# Altium schematic sheet Power Stage.SchDoc: Power Unit Stage
size A3; Date: 28.08.2010; ApprovedBy: V.Gyurov; CheckedBy: V.Gyurov; Author: V.Gyurov; CompanyName: V.Gyurov; DrawnBy: V.Gyurov; Engineer: V.Gyurov; DocumentNumber: 2; Revision: 00; SheetNumber: 2; SheetTotal: 7; VersionControl_RevNumber: V1.00 R.00; CurrentDate: 28.08.2010; DocumentName: Power Unit Stage; ModifiedDate: 28.08.2010
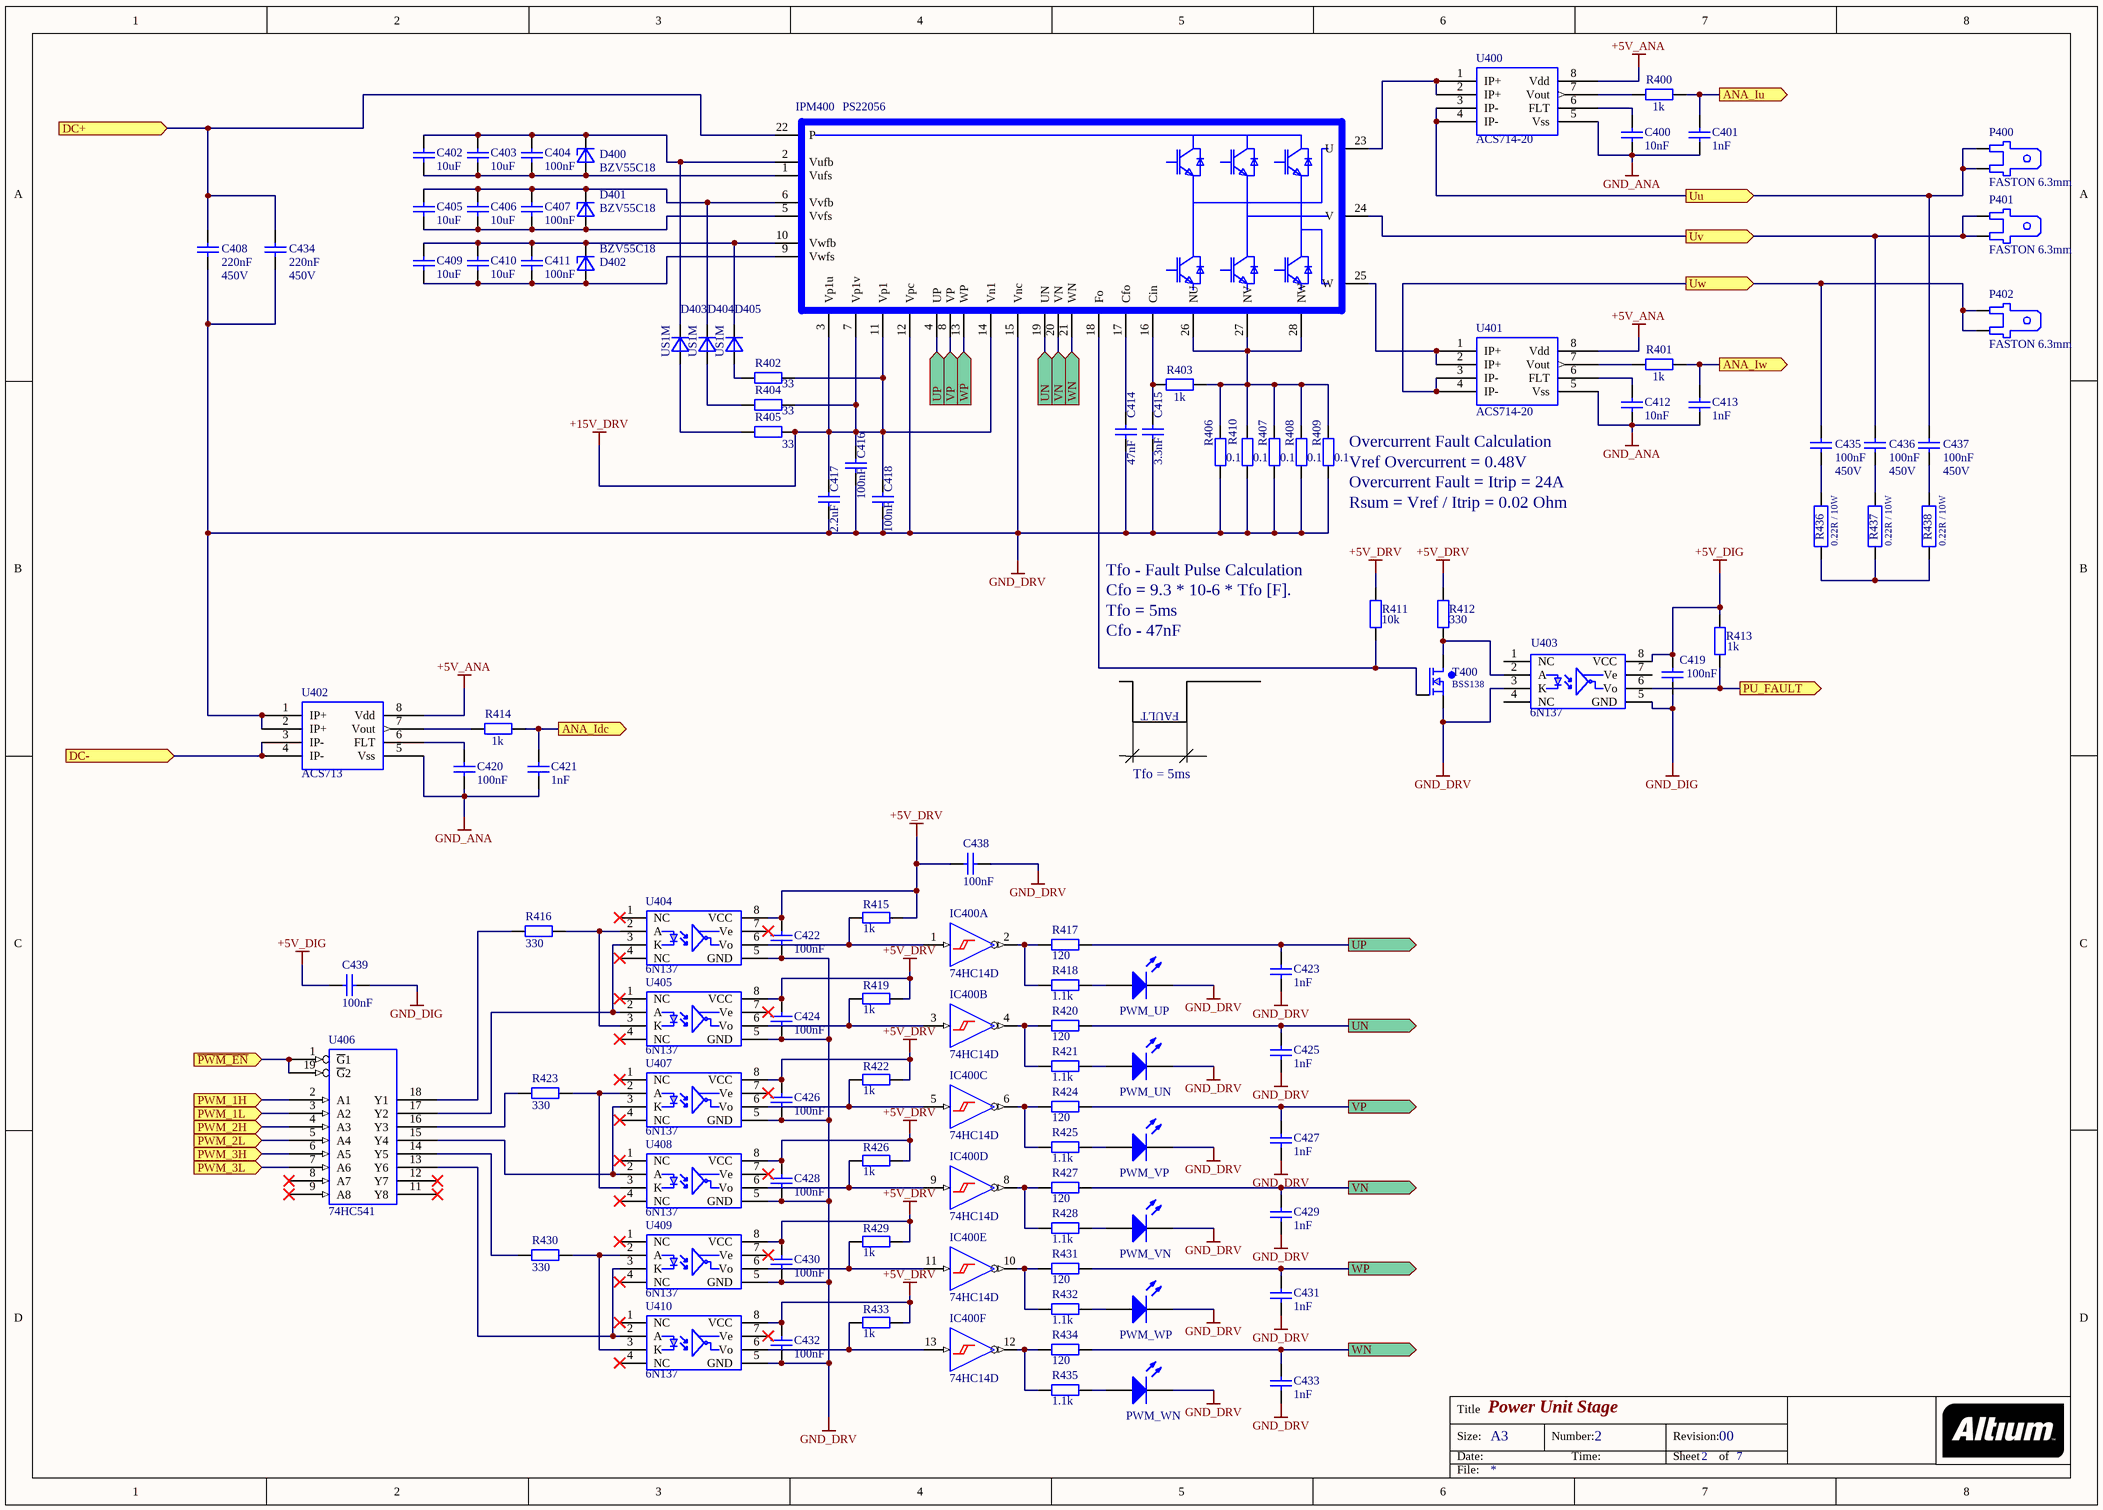
[diagram p0: Power Stage.SchDoc]

## Parts
C400  value 10nF  [1206_REFLOW]  (hidden comment: Cap 1206)
C401  value 1nF  [1206_REFLOW]  (hidden comment: Cap 1206)
C402  value 10uF  [1206_REFLOW]  (hidden comment: Cap 1206)
C403  value 10uF  [1206_REFLOW]  (hidden comment: Cap 1206)
C404  value 100nF  [1206_REFLOW]  (hidden comment: Cap 1206)
C405  value 10uF  [1206_REFLOW]  (hidden comment: Cap 1206)
C406  value 10uF  [1206_REFLOW]  (hidden comment: Cap 1206)
C407  value 100nF  [1206_REFLOW]  (hidden comment: Cap 1206)
C408  value 220nF  Voltage: 450V  [CAP26X19P22_5H]  (hidden comment: Cap)
C409  value 10uF  [1206_REFLOW]  (hidden comment: Cap 1206)
C410  value 10uF  [1206_REFLOW]  (hidden comment: Cap 1206)
C411  value 100nF  [1206_REFLOW]  (hidden comment: Cap 1206)
C412  value 10nF  [1206_REFLOW]  (hidden comment: Cap 1206)
C413  value 1nF  [1206_REFLOW]  (hidden comment: Cap 1206)
C414  value 47nF  [1206_REFLOW]  (hidden comment: Cap 1206)
C415  value 3.3nF  [1206_REFLOW]  (hidden comment: Cap 1206)
C416  value 100nF  [1206_REFLOW]  (hidden comment: Cap 1206)
C417  value 2.2uF  [1206_REFLOW]  (hidden comment: Cap 1206)
C418  value 100nF  [1206_REFLOW]  (hidden comment: Cap 1206)
C419  value 100nF  [1206_REFLOW]  (hidden comment: Cap 1206)
C420  value 100nF  [1206_REFLOW]  (hidden comment: Cap 1206)
C421  value 1nF  [1206_REFLOW]  (hidden comment: Cap 1206)
C422  value 100nF  [1206_REFLOW]  (hidden comment: Cap 1206)
C423  value 1nF  [1206_REFLOW]  (hidden comment: Cap 1206)
C424  value 100nF  [1206_REFLOW]  (hidden comment: Cap 1206)
C425  value 1nF  [1206_REFLOW]  (hidden comment: Cap 1206)
C426  value 100nF  [1206_REFLOW]  (hidden comment: Cap 1206)
C427  value 1nF  [1206_REFLOW]  (hidden comment: Cap 1206)
C428  value 100nF  [1206_REFLOW]  (hidden comment: Cap 1206)
C429  value 1nF  [1206_REFLOW]  (hidden comment: Cap 1206)
C430  value 100nF  [1206_REFLOW]  (hidden comment: Cap 1206)
C431  value 1nF  [1206_REFLOW]  (hidden comment: Cap 1206)
C432  value 100nF  [1206_REFLOW]  (hidden comment: Cap 1206)
C433  value 1nF  [1206_REFLOW]  (hidden comment: Cap 1206)
C434  value 220nF  Voltage: 450V  [CAP26X19P22_5H]  (hidden comment: Cap)
C435  value 100nF  Voltage: 450V  [CAP26X19P22_5H]  (hidden comment: Cap)
C436  value 100nF  Voltage: 450V  [CAP26X19P22_5H]  (hidden comment: Cap)
C437  value 100nF  Voltage: 450V  [CAP26X19P22_5H]  (hidden comment: Cap)
C438  value 100nF  [1206_REFLOW]  (hidden comment: Cap 1206)
C439  value 100nF  [1206_REFLOW]  (hidden comment: Cap 1206)
D400  value BZV55C18  [D_MINIMELF_BZV55C5V1(Primary)]  (hidden comment: BZV55CXXX)
D401  value BZV55C18  [D_MINIMELF_BZV55C5V1(Primary)]  (hidden comment: BZV55CXXX)
D402  value BZV55C18  [D_MINIMELF_BZV55C5V1(Primary)]  (hidden comment: BZV55CXXX)
D403  US1M  [DO-214_S1A(Primary)]
D404  value US1M  [DO-214_S1A(Primary)]  (hidden comment: S1A)
D405  value US1M  [DO-214_S1A(Primary)]  (hidden comment: S1A)
IC400  value 74HC14D  [SO14_HIS]  (hidden comment: SN74HC14D)  (parts A,B,C,D,E,F of 6)
IPM400  value PS22056  [PS22054]  (hidden comment: Component_1)
P400  FASTON 6.3MM  [FASTON 6.3mm]
P401  FASTON 6.3MM  [FASTON 6.3mm]
P402  FASTON 6.3MM  [FASTON 6.3mm]
PWM_UN  LED  [LED_1206]  (value not drawn)
PWM_UP  LED  [LED_1206]  (value not drawn)
PWM_VN  LED  [LED_1206]  (value not drawn)
PWM_VP  LED  [LED_1206]  (value not drawn)
PWM_WN  LED  [LED_1206]  (value not drawn)
PWM_WP  LED  [LED_1206]  (value not drawn)
R400  value 1k  [1206_REFLOW]  (hidden comment: RES)
R401  value 1k  [1206_REFLOW]  (hidden comment: RES)
R402  value 33  [1206_REFLOW]  (hidden comment: RES)
R403  value 1k  [1206_REFLOW]  (hidden comment: RES)
R404  value 33  [1206_REFLOW]  (hidden comment: RES)
R405  value 33  [1206_REFLOW]  (hidden comment: RES)
R406  value 0.1  [1206_REFLOW]  (hidden comment: RES)
R407  value 0.1  [1206_REFLOW]  (hidden comment: RES)
R408  value 0.1  [1206_REFLOW]  (hidden comment: RES)
R409  value 0.1  [1206_REFLOW]  (hidden comment: RES)
R410  value 0.1  [1206_REFLOW]  (hidden comment: RES)
R411  value 10k  [1206_REFLOW]  (hidden comment: RES)
R412  value 330  [1206_REFLOW]  (hidden comment: RES)
R413  value 1k  [1206_REFLOW]  (hidden comment: RES)
R414  value 1k  [1206_REFLOW]  (hidden comment: RES)
R415  value 1k  [1206_REFLOW]  (hidden comment: RES)
R416  value 330  [1206_REFLOW]  (hidden comment: RES)
R417  value 120  [1206_REFLOW]  (hidden comment: RES)
R418  value 1.1k  [1206_REFLOW]  (hidden comment: RES)
R419  value 1k  [1206_REFLOW]  (hidden comment: RES)
R420  value 120  [1206_REFLOW]  (hidden comment: RES)
R421  value 1.1k  [1206_REFLOW]  (hidden comment: RES)
R422  value 1k  [1206_REFLOW]  (hidden comment: RES)
R423  value 330  [1206_REFLOW]  (hidden comment: RES)
R424  value 120  [1206_REFLOW]  (hidden comment: RES)
R425  value 1.1k  [1206_REFLOW]  (hidden comment: RES)
R426  value 1k  [1206_REFLOW]  (hidden comment: RES)
R427  value 120  [1206_REFLOW]  (hidden comment: RES)
R428  value 1.1k  [1206_REFLOW]  (hidden comment: RES)
R429  value 1k  [1206_REFLOW]  (hidden comment: RES)
R430  value 330  [1206_REFLOW]  (hidden comment: RES)
R431  value 120  [1206_REFLOW]  (hidden comment: RES)
R432  value 1.1k  [1206_REFLOW]  (hidden comment: RES)
R433  value 1k  [1206_REFLOW]  (hidden comment: RES)
R434  value 120  [1206_REFLOW]  (hidden comment: RES)
R435  value 1.1k  [1206_REFLOW]  (hidden comment: RES)
R436  value 0.22R / 10W  [RES 10W]  (hidden comment: RES 10W)
R437  value 0.22R / 10W  [RES 10W]  (hidden comment: RES 10W)
R438  value 0.22R / 10W  [RES 10W]  (hidden comment: RES 10W)
T400  value BSS138  [SOT23_HIS_Primary]  (hidden comment: MOSFET N SOT23)
U400  value ACS714-20  [SO8]  (hidden comment: ACS714)
U401  value ACS714-20  [SO8]  (hidden comment: ACS714)
U402  ACS713  [SO8]
U403  6N137  [SO8_HIS]
U404  6N137  [SO8_HIS]
U405  6N137  [SO8_HIS]
U406  74HC541  [SOL20]
U407  6N137  [SO8_HIS]
U408  6N137  [SO8_HIS]
U409  6N137  [SO8_HIS]
U410  6N137  [SO8_HIS]

## Ports
ANA_Idc (out), ANA_Iu (out), ANA_Iw (out), DC+ (in), DC- (in), PU_FAULT (out), PWM_1H (in), PWM_1L (in), PWM_2H (in), PWM_2L (in), PWM_3H (in), PWM_3L (in), UN (in), UN (out), UP (in), UP (out), Uu (out), Uv (out), Uw (out), VN (in), VN (out), VP (in), VP (out), WN (in), WN (out), WP (in), WP (out), ~{PWM_EN} (in)

## Nets
+5V_ANA: U400.8(Vdd) U401.8(Vdd) U402.8(Vdd)
+5V_DIG: C419.2 C439.2 R413.2 U403.8(VCC) U406.20(VCC)
+5V_DRV: C422.2 C424.2 C426.2 C428.2 C430.2 C432.2 C438.2 IC400.14(VCC) R411.2 R412.2 R415.2 R419.2 R422.2 R426.2 R429.2 R433.2 U404.8(VCC) U405.8(VCC) U407.8(VCC) U408.8(VCC) U409.8(VCC) U410.8(VCC)
+15V_DRV: C416.2 C417.2 C418.2 IPM400.3(Vp1u) IPM400.7(Vp1v) IPM400.11(Vp1) IPM400.14(Vn1) R402.2 R404.2 R405.2
GND_ANA: C400.1 C401.1 C412.1 C413.1 C420.1 C421.1 U400.5(Vss) U401.5(Vss) U402.5(Vss)
GND_DIG: C419.1 C439.1 U403.5(GND) U406.10(GND)
GND_DRV: C408.1 C414.1 C415.1 C416.1 C417.1 C418.1 C422.1 C423.1 C424.1 C425.1 C426.1 C427.1 C428.1 C429.1 C430.1 C431.1 C432.1 C433.1 C434.1 C438.1 IC400.7(GND) IPM400.12(Vpc) IPM400.15(Vnc) PWM_UN.K PWM_UP.K PWM_VN.K PWM_VP.K PWM_WN.K PWM_WP.K R406.1 R407.1 R408.1 R409.1 R410.1 T400.2(S) U402.1(IP+) U402.2(IP+) U403.3(K) U404.5(GND) U405.5(GND) U407.5(GND) U408.5(GND) U409.5(GND) U410.5(GND)
ANA_Idc: C421.2 R414.2 ; port ANA_Idc
ANA_Iu: C401.2 R400.2 ; port ANA_Iu
ANA_Iw: C413.2 R401.2 ; port ANA_Iw
DC+: C408.2 C434.2 IPM400.22(P) ; port DC+
DC-: U402.3(IP-) U402.4(IP-) ; port DC-
~{PWM_EN}: U406.1(~{G}1) U406.19(~{G}2) ; port ~{PWM_EN}
PU_FAULT: R413.1 U403.6(Vo) ; port PU_FAULT
PWM_1H: U406.2(A1) ; port PWM_1H
PWM_1L: U406.3(A2) ; port PWM_1L
PWM_2H: U406.4(A3) ; port PWM_2H
PWM_2L: U406.5(A4) ; port PWM_2L
PWM_3H: U406.6(A5) ; port PWM_3H
PWM_3L: U406.7(A6) ; port PWM_3L
UN: C425.2 IPM400.19(UN) R420.2 ; port UN
UP: C423.2 IPM400.4(UP) R417.2 ; port UP
Uu: C437.2 P400.1 P400.2 U400.3(IP-) U400.4(IP-) ; port Uu
Uv: C436.2 IPM400.24(V) P401.1 P401.2 ; port Uv
Uw: C435.2 P402.1 P402.2 U401.3(IP-) U401.4(IP-) ; port Uw
VN: C429.2 IPM400.20(VN) R427.2 ; port VN
VP: C427.2 IPM400.8(VP) R424.2 ; port VP
WN: C433.2 IPM400.21(WN) R434.2 ; port WN
WP: C431.2 IPM400.13(WP) R431.2 ; port WP
NetC400_2: C400.2 U400.6(FLT)
NetC402_1: C402.1 C403.1 C404.1 D400.A IPM400.1(Vufs)
NetC402_2: C402.2 C403.2 C404.2 D400.K D403.K IPM400.2(Vufb)
NetC405_1: C405.1 C406.1 C407.1 D401.A IPM400.5(Vvfs)
NetC405_2: C405.2 C406.2 C407.2 D401.K D404.K IPM400.6(Vvfb)
NetC409_1: C409.1 C410.1 C411.1 D402.A IPM400.9(Vwfs)
NetC409_2: C409.2 C410.2 C411.2 D402.K D405.K IPM400.10(Vwfb)
NetC412_2: C412.2 U401.6(FLT)
NetC414_2: C414.2 IPM400.17(Cfo)
NetC415_2: C415.2 IPM400.16(Cin) R403.1
NetC420_2: C420.2 U402.6(FLT)
NetC435_1: C435.1 R436.1
NetC436_1: C436.1 R437.1
NetC437_1: C437.1 R438.1
NetD403_A: D403.A R405.1
NetD404_A: D404.A R404.1
NetD405_A: D405.A R402.1
NetIC400_1: IC400.1(A) R415.1 U404.6(Vo)
NetIC400_2: IC400.2(Y) R417.1 R418.1
NetIC400_3: IC400.3(A) R419.1 U405.6(Vo)
NetIC400_4: IC400.4(Y) R420.1 R421.1
NetIC400_5: IC400.5(A) R422.1 U407.6(Vo)
NetIC400_6: IC400.6(Y) R424.1 R425.1
NetIC400_8: IC400.8(Y) R427.1 R428.1
NetIC400_9: IC400.9(A) R426.1 U408.6(Vo)
NetIC400_10: IC400.10(Y) R431.1 R432.1
NetIC400_11: IC400.11(A) R429.1 U409.6(Vo)
NetIC400_12: IC400.12(Y) R434.1 R435.1
NetIC400_13: IC400.13(A) R433.1 U410.6(Vo)
NetIPM400_18: IPM400.18(Fo) R411.1 T400.1(G)
NetIPM400_23: IPM400.23(U) U400.1(IP+) U400.2(IP+)
NetIPM400_25: IPM400.25(W) U401.1(IP+) U401.2(IP+)
NetIPM400_26: IPM400.26(NU) IPM400.27(NV) IPM400.28(NW) R403.2 R406.2 R407.2 R408.2 R409.2 R410.2
NetPWM_UN_A: PWM_UN.A R421.2
NetPWM_UP_A: PWM_UP.A R418.2
NetPWM_VN_A: PWM_VN.A R428.2
NetPWM_VP_A: PWM_VP.A R425.2
NetPWM_WN_A: PWM_WN.A R435.2
NetPWM_WP_A: PWM_WP.A R432.2
NetR400_1: R400.1 U400.7(Vout)
NetR401_1: R401.1 U401.7(Vout)
NetR412_1: R412.1 T400.3(D) U403.2(A)
NetR414_1: R414.1 U402.7(Vout)
NetR416_1: R416.1 U406.18(Y1)
NetR416_2: R416.2 U404.2(A) U405.3(K)
NetR423_1: R423.1 U406.16(Y3)
NetR423_2: R423.2 U407.2(A) U408.3(K)
NetR430_1: R430.1 U406.14(Y5)
NetR430_2: R430.2 U409.2(A) U410.3(K)
NetR436_2: R436.2 R437.2 R438.2
NetU404_3: U404.3(K) U405.2(A) U406.17(Y2)
NetU406_13: U406.13(Y6) U409.3(K) U410.2(A)
NetU406_15: U406.15(Y4) U407.3(K) U408.2(A)

Not connected (* = marked no-connect by the designer): U403 1(NC) 4(NC) 7(Ve); U404 1(NC)* 4(NC)* 7(Ve)*; U405 1(NC)* 4(NC)* 7(Ve)*; U406 8(A7)* 9(A8)* 11(Y8)* 12(Y7)*; U407 1(NC)* 4(NC)* 7(Ve)*; U408 1(NC)* 4(NC)* 7(Ve)*; U409 1(NC)* 4(NC)* 7(Ve)*; U410 1(NC)* 4(NC)* 7(Ve)*

## Notes on the sheet
- (near R409) Overcurrent Fault Calculation
- (near R409) Overcurrent Fault = Itrip = 24A
- (near R409) Vref Overcurrent = 0.48V
- Rsum = Vref / Itrip = 0.02 Ohm
- (near R411) Tfo - Fault Pulse Calculation
- (near R411) Cfo = 9.3 * 10-6 * Tfo [F].
- Tfo = 5ms
- Cfo - 47nF
- FAULT
- Title
- Size:
- Date:
- A3
- Number:
- Time:
- Revision:
- Sheet
- of
- File:

## Library data of the parts
D400-D402 = BZV55CXXX: Zener Diode
D403 = S1A: Value: US1M
IC400 = SN74HC14D: Hex Schmitt-Trigger INVERTERS; Group: IC; Subgroup: Logic; Subgroup1: Gate; Package: SO14; Mounting: SMD
IPM400 = Component_1: Description: IPM Module
PWM_UN PWM_UP PWM_VN PWM_VP PWM_WN PWM_WP = LED: Value: TBD
R400-R435 = RES 1
U403-U405 U407-U410 = 6N137: Single Optocoupler; Manufacturer: Agilent; Value: 6N137
P400-P402 = FASTON 6.3MM: Value: FASTON 6.3mm
U402 = ACS713: Value: ACS713
U406 = 74HC541: Value: 74HC541